# Altium schematic sheet schema_projet_mai_juin_gamestation.SchDoc
size A4; SheetNumber: 1; SheetTotal: 1
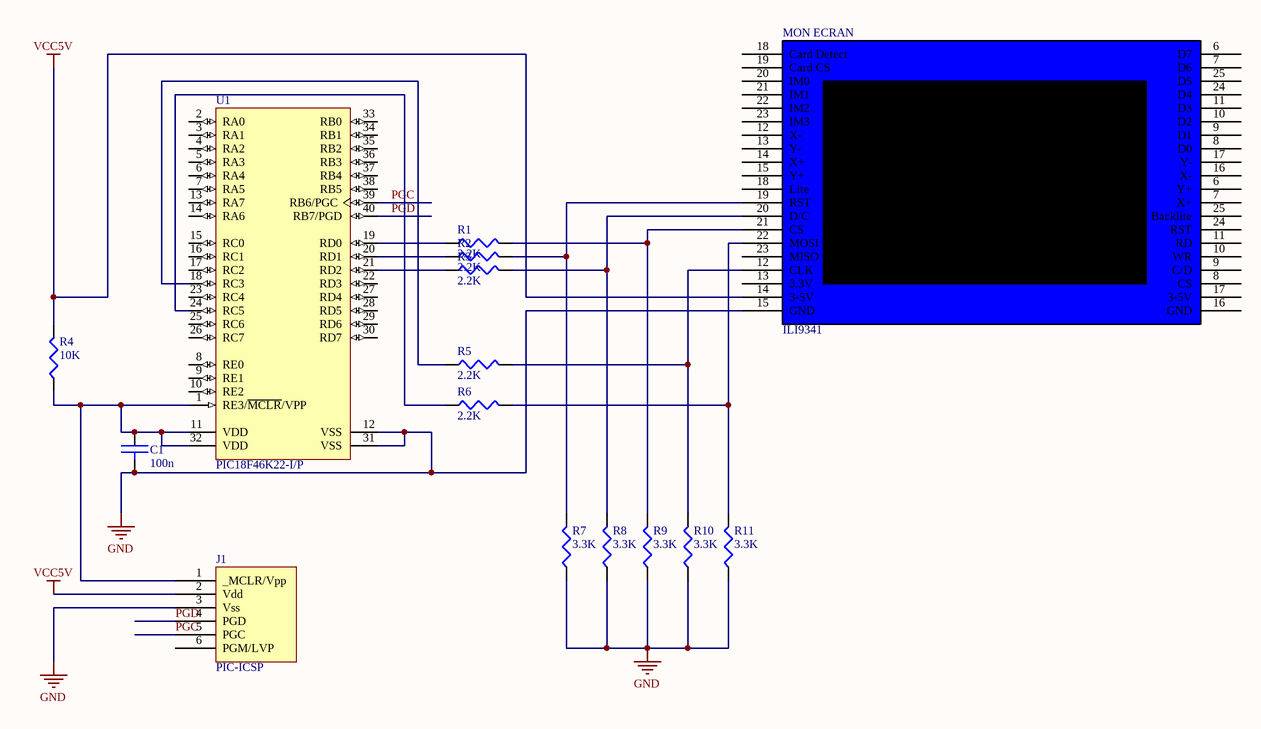
[diagram p0: schema_projet_mai_juin_gamestation.SchDoc]

## Parts
C1  value 100n  [0402]  (hidden comment: CAP)
J1  PIC-ICSP  [PIC-ICSP]
MON_ECRAN  ILI9341
R1  value 2.2K  [0201]  (hidden comment: RES)
R2  value 2.2K  [0201]  (hidden comment: RES)
R3  value 2.2K  [0201]  (hidden comment: RES)
R4  value 10K  [0201]  (hidden comment: RES)
R5  value 2.2K  [0201]  (hidden comment: RES)
R6  value 2.2K  [0201]  (hidden comment: RES)
R7  value 3.3K  [0201]  (hidden comment: RES)
R8  value 3.3K  [0201]  (hidden comment: RES)
R9  value 3.3K  [0201]  (hidden comment: RES)
R10  value 3.3K  [0201]  (hidden comment: RES)
R11  value 3.3K  [0201]  (hidden comment: RES)
U1  PIC18F46K22-I/P  [MCHP-PDIP-P40]

## Nets
GND: C1.2 J1.3(Vss) MON_ECRAN.15(Y+) R7.1 R8.1 R9.1 R10.1 R11.1 U1.12(VSS) U1.31(VSS)
VCC5V: J1.2(Vdd) MON_ECRAN.14(X+) R4.2
PGC: J1.5(PGC) U1.39(RB6/PGC)
PGD: J1.4(PGD) U1.40(RB7/PGD)
NetC1_1: C1.1 J1.1(_MCLR/Vpp) R4.1 U1.1(RE3/~{MCLR}/VPP) U1.11(VDD) U1.32(VDD)
NetMON_ECRAN_12: MON_ECRAN.12(X-) R5.2 R10.2
NetMON_ECRAN_19: MON_ECRAN.19(Card_CS) R2.2 R7.2
NetMON_ECRAN_20: MON_ECRAN.20(IM0) R3.2 R8.2
NetMON_ECRAN_21: MON_ECRAN.21(IM1) R1.2 R9.2
NetMON_ECRAN_22: MON_ECRAN.22(IM2) R6.2 R11.2
NetR1_1: R1.1 U1.19(RD0)
NetR2_1: R2.1 U1.20(RD1)
NetR3_1: R3.1 U1.21(RD2)
NetR5_1: R5.1 U1.18(RC3)
NetR6_1: R6.1 U1.24(RC5)

Not connected (* = marked no-connect by the designer): J1 6(PGM/LVP); MON_ECRAN 6(D7) 7(D6) 8(D0) 9(D1) 10(D2) 11(D3) 13(Y-) 16(X-) 17(Y-) 18(Card_Detect) 23(IM3) 24(D4) 25(D5); U1 2(RA0) 3(RA1) 4(RA2) 5(RA3) 6(RA4) 7(RA5) 8(RE0) 9(RE1) 10(RE2) 13(RA7) 14(RA6) 15(RC0) 16(RC1) 17(RC2) 22(RD3) 23(RC4) 25(RC6) 26(RC7) 27(RD4) 28(RD5) 29(RD6) 30(RD7) 33(RB0) 34(RB1) 35(RB2) 36(RB3) 37(RB4) 38(RB5)

## Library data of the parts
C1 = CAP: capacité non polarisée
MON_ECRAN = Component_1
R1-R11 = RES: resistance
U1 = PIC18F46K22-I/P: Low-Power, High-Performance Microcontroller with XLP Technology, 64 MHz, 35 I/O, -40 to 85 degC, 40-pin PDIP (P40), Tube; Manufacturer: Microchip; # of A/D Channels: 28; Digital Communication: 2 -A/E/USART, 2 -MSSP(SPI/I2C); EEPROM Data Memory (bytes): 1024; I/O Pins: 35; Internal Oscillator: 16 MHz, 31 kHz; Max. CPU Speed MHz: 64; Memory Type: Flash; Operation Voltage Range: 2.3V - 5.5V; Program Memory KWords: 32; RAM: 3896; Timers: 3 - 8-bit, 4 - 16-bit; DatasheetVersion: Rev. F; PackageVersion: C04-016B, 04/2013; PackageReference: PDIP-P40; PackageDescription: 40-Lead Plastic Dual In-Line Package, Body 51.75 x 13.53 mm, Pitch 2.54 mm; Supplier 1: Digi-Key; Supplier Part Number 1: PIC18F46K22-I/P-ND; Supplier 2: Farnell; Supplier Part Number 2: 1814979; Supplier 3: Newark; Supplier Part Number 3: 65R6012; Supplier 4: Mouser; Supplier Part Number 4: 579-PIC18F46K22IP; Packing: TUBE; Program Memory KBytes: 64; RoHS: TRUE; Mounting Technology: Through Hole; PartNumber: PIC18F46K22-I/P; ComponentLink1Description: Datasheet; ComponentLink1URL: http://ww1.microchip.com/downloads/en/DeviceDoc/41412F.pdf; ComponentLink2Description: Package Specification; ComponentLink2URL: http://www.microchip.com/stellent/groups/techpub_sg/documents/packagingspec/en012702.pdf; ComponentLink3Description: URL Link1; ComponentLink3URL: Product URL:http://www.microchip.com/datasheet/PIC18F46K22